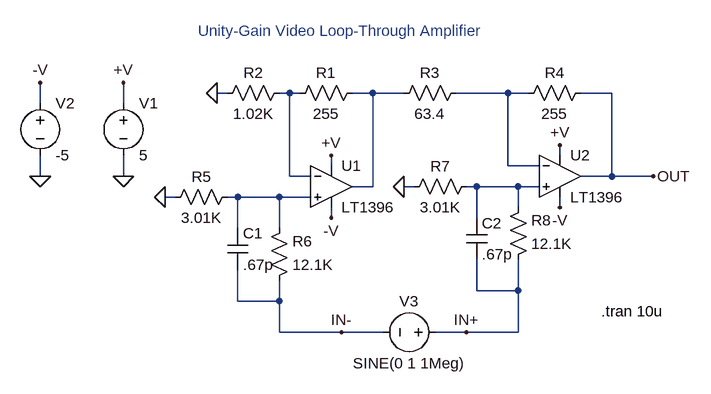
[diagram p0: schematic 1396.asc]
1396.asc, the LTspice schematic file:
Version 4
SHEET 1 896 680
WIRE 32 96 16 96
WIRE 128 96 112 96
WIRE 144 96 128 96
WIRE 256 96 224 96
WIRE 304 96 256 96
WIRE 464 96 384 96
WIRE 496 96 464 96
WIRE 624 96 576 96
WIRE -256 112 -256 80
WIRE -128 112 -128 80
WIRE 544 192 544 176
WIRE 192 208 192 192
WIRE 464 208 464 96
WIRE 512 208 464 208
WIRE -256 224 -256 192
WIRE -128 224 -128 192
WIRE 128 224 128 96
WIRE 160 224 128 224
WIRE 624 224 624 96
WIRE 624 224 576 224
WIRE 688 224 624 224
WIRE 256 240 256 96
WIRE 256 240 224 240
WIRE 320 240 304 240
WIRE 416 240 400 240
WIRE 480 240 416 240
WIRE 512 240 480 240
WIRE -48 256 -64 256
WIRE 48 256 32 256
WIRE 112 256 48 256
WIRE 160 256 112 256
WIRE 480 272 480 240
WIRE 544 272 544 256
WIRE 192 288 192 272
WIRE 416 288 416 240
WIRE 48 304 48 256
WIRE 112 304 112 256
WIRE 416 400 416 352
WIRE 480 400 480 352
WIRE 480 400 416 400
WIRE 48 416 48 368
WIRE 112 416 112 384
WIRE 112 416 48 416
WIRE 112 464 112 416
WIRE 208 464 112 464
WIRE 272 464 208 464
WIRE 400 464 352 464
WIRE 480 464 480 400
WIRE 480 464 400 464
FLAG -128 224 0
FLAG 192 192 +V
FLAG -128 80 +V
FLAG 192 288 -V
FLAG -256 224 0
FLAG -256 80 -V
FLAG 16 96 0
FLAG 544 176 +V
FLAG 544 272 -V
FLAG -64 256 0
FLAG 304 240 0
FLAG 688 224 OUT
FLAG 400 464 IN+
FLAG 208 464 IN-
SYMBOL voltage -128 96 R0
SYMATTR InstName V1
SYMATTR Value 5
SYMBOL voltage -256 96 R0
SYMATTR InstName V2
SYMATTR Value -5
SYMBOL res 240 80 R90
WINDOW 0 0 56 VBottom 0
WINDOW 3 32 56 VTop 0
SYMATTR InstName R1
SYMATTR Value 255
SYMBOL res 128 80 R90
WINDOW 0 0 56 VBottom 0
WINDOW 3 32 56 VTop 0
SYMATTR InstName R2
SYMATTR Value 1.02K
SYMBOL opamps\\LT1396 192 176 R0
SYMATTR InstName U1
SYMBOL res 400 80 R90
WINDOW 0 0 56 VBottom 0
WINDOW 3 32 56 VTop 0
SYMATTR InstName R3
SYMATTR Value 63.4
SYMBOL res 592 80 R90
WINDOW 0 0 56 VBottom 0
WINDOW 3 32 56 VTop 0
SYMATTR InstName R4
SYMATTR Value 255
SYMBOL opamps\\LT1396 544 160 R0
SYMATTR InstName U2
SYMBOL res 48 240 R90
WINDOW 0 0 56 VBottom 0
WINDOW 3 32 56 VTop 0
SYMATTR InstName R5
SYMATTR Value 3.01K
SYMBOL res 96 400 M180
WINDOW 0 36 76 Left 0
WINDOW 3 36 40 Left 0
SYMATTR InstName R6
SYMATTR Value 12.1K
SYMBOL cap 32 304 R0
SYMATTR InstName C1
SYMATTR Value .67p
SYMBOL res 416 224 R90
WINDOW 0 0 56 VBottom 0
WINDOW 3 32 56 VTop 0
SYMATTR InstName R7
SYMATTR Value 3.01K
SYMBOL res 464 368 M180
WINDOW 0 36 76 Left 0
WINDOW 3 36 40 Left 0
SYMATTR InstName R8
SYMATTR Value 12.1K
SYMBOL cap 400 288 R0
SYMATTR InstName C2
SYMATTR Value .67p
SYMBOL voltage 368 464 R90
WINDOW 0 -32 56 VBottom 0
WINDOW 3 32 56 VTop 0
SYMATTR InstName V3
SYMATTR Value SINE(0 1 1Meg)
TEXT 608 432 Left 0 !.tran 10u
TEXT 208 16 Bottom 0 ;Unity-Gain Video Loop-Through Amplifier

The netlist it stands for:
* 1396.asc
V1 +V 0 5
V2 -V 0 -5
R1 N002 N001 255
R2 N001 0 1.02K
XU1 N005 N001 +V -V N002 LT1396  ; pins In+ In- V+ V- OUT
R3 N003 N002 63.4
R4 OUT N003 255
XU2 N004 N003 +V -V OUT LT1396  ; pins In+ In- V+ V- OUT
R5 N005 0 3.01K
R6 IN- N005 12.1K
C1 N005 IN- .67p
R7 N004 0 3.01K
R8 IN+ N004 12.1K
C2 N004 IN+ .67p
V3 IN+ IN- SINE(0 1 1Meg)
.tran 10u
* Unity-Gain Video Loop-Through Amplifier
.backanno
.end